# EAGLE design PCB-BI8-3x5C3_V2 (EAGLE 7.1.0)

## Sheet 1 of 2
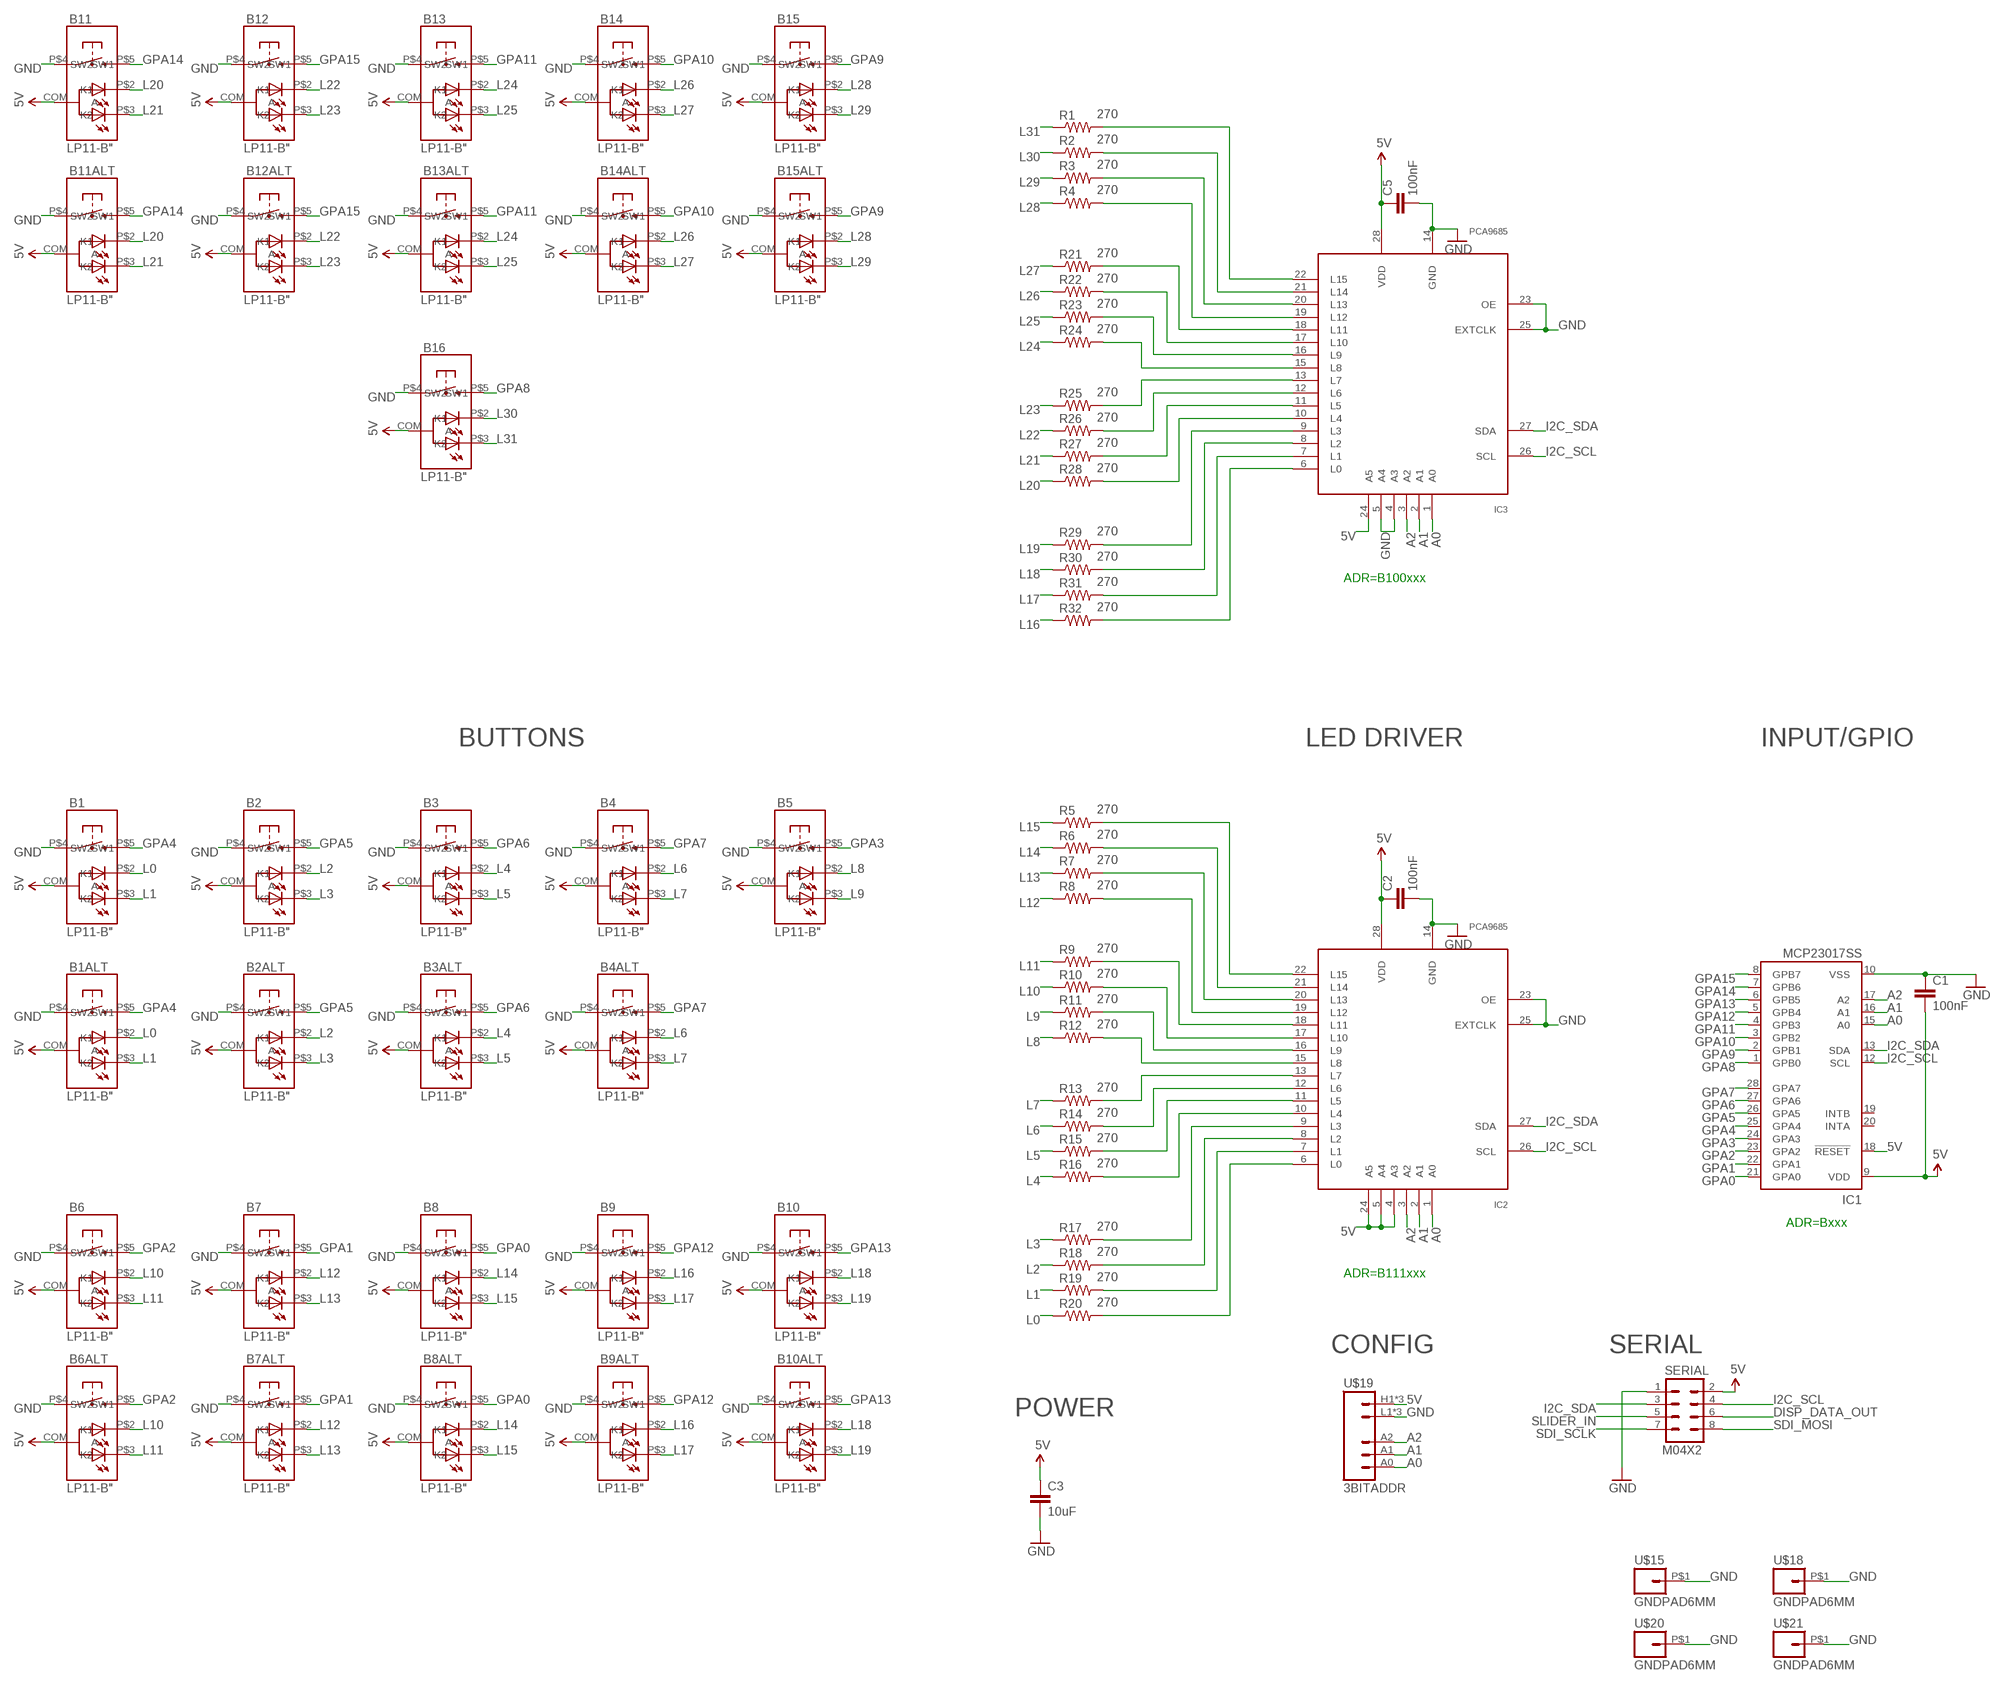
[diagram p0: schematic, sheet 1]

### Parts
B1  LP11-B"  [LP11]
B1ALT  LP11-B"  [LP11]
B2  LP11-B"  [LP11]
B2ALT  LP11-B"  [LP11]
B3  LP11-B"  [LP11]
B3ALT  LP11-B"  [LP11]
B4  LP11-B"  [LP11]
B4ALT  LP11-B"  [LP11]
B5  LP11-B"  [LP11]
B6  LP11-B"  [LP11]
B6ALT  LP11-B"  [LP11]
B7  LP11-B"  [LP11]
B7ALT  LP11-B"  [LP11]
B8  LP11-B"  [LP11]
B8ALT  LP11-B"  [LP11]
B9  LP11-B"  [LP11]
B9ALT  LP11-B"  [LP11]
B10  LP11-B"  [LP11]
B10ALT  LP11-B"  [LP11]
B11  LP11-B"  [LP11]
B11ALT  LP11-B"  [LP11]
B12  LP11-B"  [LP11]
B12ALT  LP11-B"  [LP11]
B13  LP11-B"  [LP11]
B13ALT  LP11-B"  [LP11]
B14  LP11-B"  [LP11]
B14ALT  LP11-B"  [LP11]
B15  LP11-B"  [LP11]
B15ALT  LP11-B"  [LP11]
B16  LP11-B"  [LP11]
C1  100nF  CAP0603-CAP  [0603-CAP]
C2  100nF  CAP0603-CAP  [0603-CAP]
C3  10uF  CAP0805  [0805]
C5  100nF  CAP0603-CAP  [0603-CAP]
IC1  MCP23017SS  [SSOP28]
IC2  PCA9685  [TSSOP28]
IC3  PCA9685  [TSSOP28]
R1  270  RESISTOR0603-RES  [0603-RES]
R2  270  RESISTOR0603-RES  [0603-RES]
R3  270  RESISTOR0603-RES  [0603-RES]
R4  270  RESISTOR0603-RES  [0603-RES]
R5  270  RESISTOR0603-RES  [0603-RES]
R6  270  RESISTOR0603-RES  [0603-RES]
R7  270  RESISTOR0603-RES  [0603-RES]
R8  270  RESISTOR0603-RES  [0603-RES]
R9  270  RESISTOR0603-RES  [0603-RES]
R10  270  RESISTOR0603-RES  [0603-RES]
R11  270  RESISTOR0603-RES  [0603-RES]
R12  270  RESISTOR0603-RES  [0603-RES]
R13  270  RESISTOR0603-RES  [0603-RES]
R14  270  RESISTOR0603-RES  [0603-RES]
R15  270  RESISTOR0603-RES  [0603-RES]
R16  270  RESISTOR0603-RES  [0603-RES]
R17  270  RESISTOR0603-RES  [0603-RES]
R18  270  RESISTOR0603-RES  [0603-RES]
R19  270  RESISTOR0603-RES  [0603-RES]
R20  270  RESISTOR0603-RES  [0603-RES]
R21  270  RESISTOR0603-RES  [0603-RES]
R22  270  RESISTOR0603-RES  [0603-RES]
R23  270  RESISTOR0603-RES  [0603-RES]
R24  270  RESISTOR0603-RES  [0603-RES]
R25  270  RESISTOR0603-RES  [0603-RES]
R26  270  RESISTOR0603-RES  [0603-RES]
R27  270  RESISTOR0603-RES  [0603-RES]
R28  270  RESISTOR0603-RES  [0603-RES]
R29  270  RESISTOR0603-RES  [0603-RES]
R30  270  RESISTOR0603-RES  [0603-RES]
R31  270  RESISTOR0603-RES  [0603-RES]
R32  270  RESISTOR0603-RES  [0603-RES]
SERIAL  M04X2  [2X4]
U$15  GNDPAD6MM  [3.2MMPAD6MM]
U$18  GNDPAD6MM  [3.2MMPAD6MM]
U$19  3BITADDR  [3BITADDR]
U$20  GNDPAD6MM  [3.2MMPAD6MM]
U$21  GNDPAD6MM  [3.2MMPAD6MM]

### Nets
5V [Power]: B1.COM(A) B1ALT.COM(A) B2.COM(A) B2ALT.COM(A) B3.COM(A) B3ALT.COM(A) B4.COM(A) B4ALT.COM(A) B5.COM(A) B6.COM(A) B6ALT.COM(A) B7.COM(A) B7ALT.COM(A) B8.COM(A) B8ALT.COM(A) B9.COM(A) B9ALT.COM(A) B10.COM(A) B10ALT.COM(A) B11.COM(A) B11ALT.COM(A) B12.COM(A) B12ALT.COM(A) B13.COM(A) B13ALT.COM(A) B14.COM(A) B14ALT.COM(A) B15.COM(A) B15ALT.COM(A) B16.COM(A) C1.2 C2.1 C3.1 C5.1 IC1.9(VDD) IC1.18(!RESET) IC2.4(A3) IC2.5(A4) IC2.24(A5) IC2.28(VDD) IC3.24(A5) IC3.28(VDD) SERIAL.2 U$19.H1(VCC) U$19.H2(VCC) U$19.H3(VCC)
A0: IC1.15(A0) IC2.1(A0) IC3.1(A0) U$19.A0
A1: IC1.16(A1) IC2.2(A1) IC3.2(A1) U$19.A1
A2: IC1.17(A2) IC2.3(A2) IC3.3(A2) U$19.A2
DISP_DATA_OUT: SERIAL.6
GND [Power]: B1.P$4(SW1) B1ALT.P$4(SW1) B2.P$4(SW1) B2ALT.P$4(SW1) B3.P$4(SW1) B3ALT.P$4(SW1) B4.P$4(SW1) B4ALT.P$4(SW1) B5.P$4(SW1) B6.P$4(SW1) B6ALT.P$4(SW1) B7.P$4(SW1) B7ALT.P$4(SW1) B8.P$4(SW1) B8ALT.P$4(SW1) B9.P$4(SW1) B9ALT.P$4(SW1) B10.P$4(SW1) B10ALT.P$4(SW1) B11.P$4(SW1) B11ALT.P$4(SW1) B12.P$4(SW1) B12ALT.P$4(SW1) B13.P$4(SW1) B13ALT.P$4(SW1) B14.P$4(SW1) B14ALT.P$4(SW1) B15.P$4(SW1) B15ALT.P$4(SW1) B16.P$4(SW1) C1.1 C2.2 C3.2 C5.2 IC1.10(VSS) IC2.14(GND) IC2.23(OE) IC2.25(EXTCLK) IC3.4(A3) IC3.5(A4) IC3.14(GND) IC3.23(OE) IC3.25(EXTCLK) SERIAL.1 U$15.P$1 U$18.P$1 U$19.L1(GND) U$19.L2(GND) U$19.L3(GND) U$20.P$1 U$21.P$1
GPA0: B8.P$5(SW2) B8ALT.P$5(SW2) IC1.21(GPA0)
GPA1: B7.P$5(SW2) B7ALT.P$5(SW2) IC1.22(GPA1)
GPA2: B6.P$5(SW2) B6ALT.P$5(SW2) IC1.23(GPA2)
GPA3: B5.P$5(SW2) IC1.24(GPA3)
GPA4: B1.P$5(SW2) B1ALT.P$5(SW2) IC1.25(GPA4)
GPA5: B2.P$5(SW2) B2ALT.P$5(SW2) IC1.26(GPA5)
GPA6: B3.P$5(SW2) B3ALT.P$5(SW2) IC1.27(GPA6)
GPA7: B4.P$5(SW2) B4ALT.P$5(SW2) IC1.28(GPA7)
GPA8: B16.P$5(SW2) IC1.1(GPB0)
GPA9: B15.P$5(SW2) B15ALT.P$5(SW2) IC1.2(GPB1)
GPA10: B14.P$5(SW2) B14ALT.P$5(SW2) IC1.3(GPB2)
GPA11: B13.P$5(SW2) B13ALT.P$5(SW2) IC1.4(GPB3)
GPA12: B9.P$5(SW2) B9ALT.P$5(SW2) IC1.5(GPB4)
GPA13: B10.P$5(SW2) B10ALT.P$5(SW2) IC1.6(GPB5)
GPA14: B11.P$5(SW2) B11ALT.P$5(SW2) IC1.7(GPB6)
GPA15: B12.P$5(SW2) B12ALT.P$5(SW2) IC1.8(GPB7)
I2C_SCL: IC1.12(SCL) IC2.26(SCL) IC3.26(SCL) SERIAL.4
I2C_SDA: IC1.13(SDA) IC2.27(SDA) IC3.27(SDA) SERIAL.3
L0: B1.P$2(K1) B1ALT.P$2(K1) R20.1
L1: B1.P$3(K2) B1ALT.P$3(K2) R19.1
L2: B2.P$2(K1) B2ALT.P$2(K1) R18.1
L3: B2.P$3(K2) B2ALT.P$3(K2) R17.1
L4: B3.P$2(K1) B3ALT.P$2(K1) R16.1
L5: B3.P$3(K2) B3ALT.P$3(K2) R15.1
L6: B4.P$2(K1) B4ALT.P$2(K1) R14.1
L7: B4.P$3(K2) B4ALT.P$3(K2) R13.1
L8: B5.P$2(K1) R12.1
L9: B5.P$3(K2) R11.1
L10: B6.P$2(K1) B6ALT.P$2(K1) R10.1
L11: B6.P$3(K2) B6ALT.P$3(K2) R9.1
L12: B7.P$2(K1) B7ALT.P$2(K1) R8.1
L13: B7.P$3(K2) B7ALT.P$3(K2) R7.1
L14: B8.P$2(K1) B8ALT.P$2(K1) R6.1
L15: B8.P$3(K2) B8ALT.P$3(K2) R5.1
L16: B9.P$2(K1) B9ALT.P$2(K1) R32.1
L17: B9.P$3(K2) B9ALT.P$3(K2) R31.1
L18: B10.P$2(K1) B10ALT.P$2(K1) R30.1
L19: B10.P$3(K2) B10ALT.P$3(K2) R29.1
L20: B11.P$2(K1) B11ALT.P$2(K1) R28.1
L21: B11.P$3(K2) B11ALT.P$3(K2) R27.1
L22: B12.P$2(K1) B12ALT.P$2(K1) R26.1
L23: B12.P$3(K2) B12ALT.P$3(K2) R25.1
L24: B13.P$2(K1) B13ALT.P$2(K1) R24.1
L25: B13.P$3(K2) B13ALT.P$3(K2) R23.1
L26: B14.P$2(K1) B14ALT.P$2(K1) R22.1
L27: B14.P$3(K2) B14ALT.P$3(K2) R21.1
L28: B15.P$2(K1) B15ALT.P$2(K1) R4.1
L29: B15.P$3(K2) B15ALT.P$3(K2) R3.1
L30: B16.P$2(K1) R2.1
L31: B16.P$3(K2) R1.1
N$1: IC3.13(L7) R25.2
N$2: IC3.12(L6) R26.2
N$3: IC3.11(L5) R27.2
N$4: IC2.13(L7) R13.2
N$5: IC2.12(L6) R14.2
N$6: IC3.10(L4) R28.2
N$7: IC2.11(L5) R15.2
N$8: IC3.9(L3) R29.2
N$9: IC2.10(L4) R16.2
N$10: IC2.9(L3) R17.2
N$11: IC2.8(L2) R18.2
N$12: IC2.7(L1) R19.2
N$13: IC3.8(L2) R30.2
N$14: IC3.7(L1) R31.2
N$15: IC3.6(L0) R32.2
N$16: IC3.15(L8) R24.2
N$17: IC3.16(L9) R23.2
N$18: IC3.17(L10) R22.2
N$19: IC2.6(L0) R20.2
N$20: IC2.15(L8) R12.2
N$21: IC2.16(L9) R11.2
N$22: IC2.17(L10) R10.2
N$23: IC2.18(L11) R9.2
N$24: IC2.19(L12) R8.2
N$25: IC2.20(L13) R7.2
N$26: IC2.21(L14) R6.2
N$27: IC2.22(L15) R5.2
N$28: IC3.18(L11) R21.2
N$29: IC3.19(L12) R4.2
N$30: IC3.20(L13) R3.2
N$31: IC3.21(L14) R2.2
N$32: IC3.22(L15) R1.2
SDI_MOSI: SERIAL.8
SDI_SCLK: SERIAL.7
SLIDER_IN: SERIAL.5
Unconnected: IC1.19(INTB) IC1.20(INTA)

### Notes on the sheet
- ADR=B100xxx
- BUTTONS | LED DRIVER | INPUT/GPIO
- ADR=Bxxx
- ADR=B111xxx
- CONFIG | SERIAL
- POWER

## Sheet 2 of 2

## Library data of the parts
B1 B1ALT B2 B2ALT B3 B3ALT B4 B4ALT B5 B6 B6ALT B7 B7ALT B8 B8ALT B9 B9ALT B10 B10ALT B11 B11ALT B12 B12ALT B13 B13ALT B14 B14ALT B15 B15ALT B16 = SKAARHOJ:LP11-B
C1-C3 C5 = SparkFun:CAP: Capacitor Standard 0603 ceramic capacitor, and 0.1" leaded capacitor.
IC1 = microchip:MCP23017: http://ww1.microchip.com/downloads/en/DeviceDoc/21952a.pdf Source: http://ww1.microchip.com/downloads/en/DeviceDoc/21952a.pdf; MF: MICROCHIP; MPN: MCP23017-E/SS; OC_FARNELL: 1467674; OC_NEWARK: 31K2960
IC2 IC3 = wsmith:PCA9685
R1-R32 = SparkFun:RESISTOR: Resistor Basic schematic elements and footprints for 0603, 1206, and PTH resistors.
SERIAL = SparkFun:M04X2
U$15 U$18 U$20 U$21 = SKAARHOJ:GNDPAD
U$19 = SKAARHOJ:3BITADDR

## Net classes
0 default: width 0.203 mm, drill 0.406 mm, clearance 0.203 mm
1 Power: width 0.406 mm, drill 0.61 mm, clearance 0.203 mm

## Board
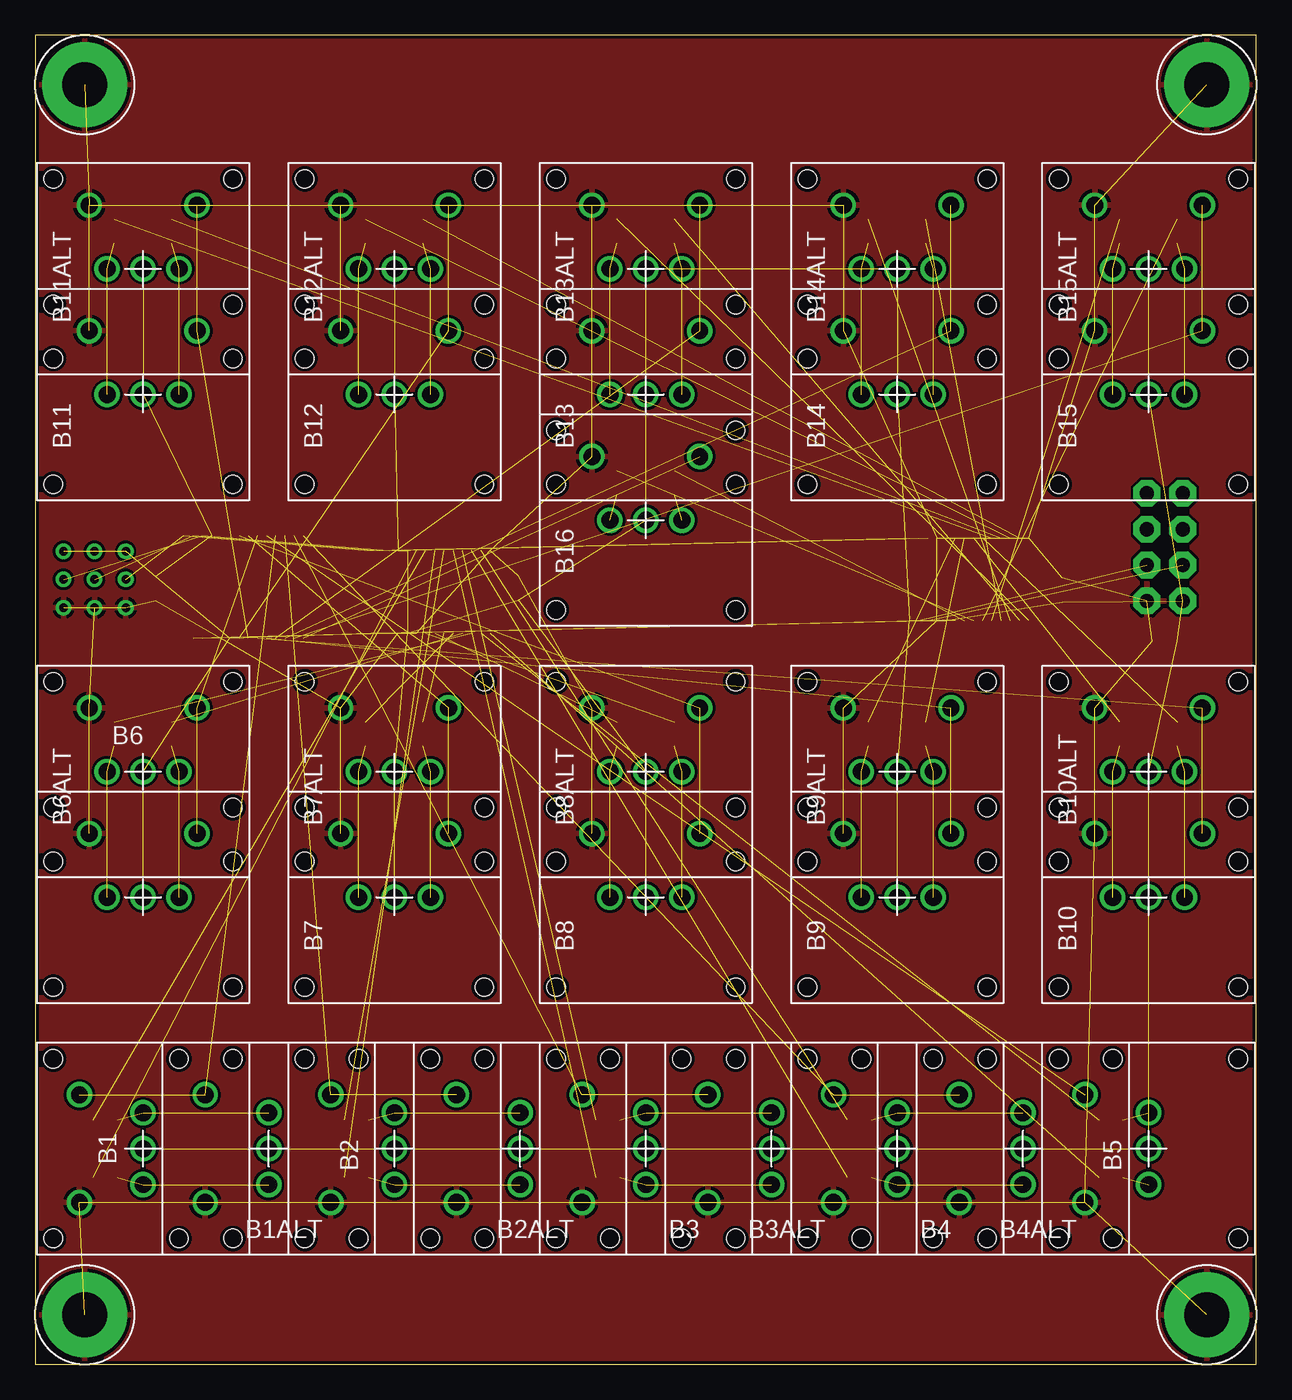
[diagram p1: board, top side]
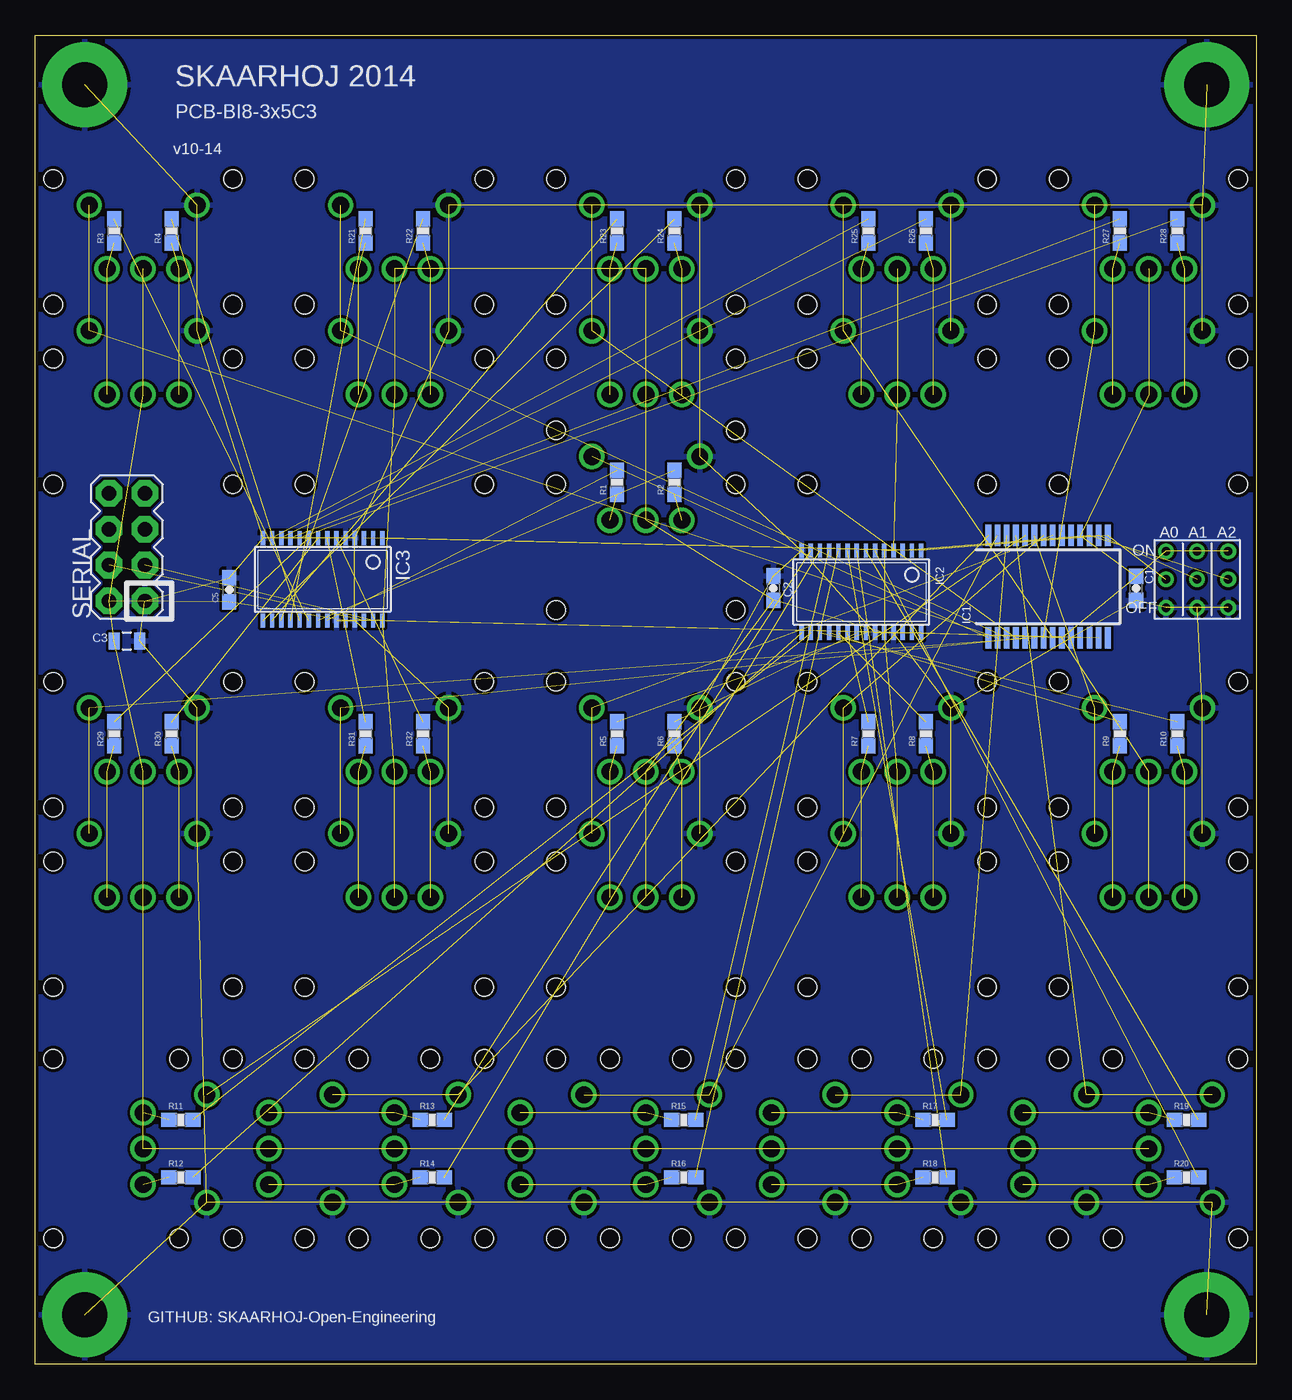
[diagram p2: board, bottom side, seen from below]

Size 86.36 x 93.98 mm. Coordinates in mm from the lower left corner, seen from the top.
Outline: 0,0 86.36,0 86.36,93.98 0,93.98 0,0
Copper layers (1*16): Top 0.035mm / dielectric 1.5mm / Bottom 0.035mm
Design rules "Fusion_eagle_rule_v1.1": minimum track width 6mil, minimum drill 12mil, track to track 6mil, track to pad 6mil, pad to pad 6mil, via to via 6mil, smd to smd 0mil, copper to edge 10mil, drill to drill 10mil, minimum pad ring 10mil, minimum via ring 6mil, stop-mask expansion 2mil, vias tented up to drill 100mil, thermal gap 10mil

### Footprints (pad centres in the part's own frame; a part is rotated, then mirrored left to right if it is on the bottom)
LP11 = drill 1.2: COM 0,0; P$2 0,2.54; P$3 0,-2.54; P$4 4.5,3.81; P$5 4.5,-3.81 | hole 1.3: -6.35,6.35; 6.35,6.35; 6.35,-6.35; -6.35,-6.35
0603-CAP = smd 1.1 x 1: 1 -0.85,0; 2 0.85,0
0805 = smd 0.8 x 1.2: 1 -0.9,0; 2 0.9,0
SSOP28 = smd 0.4 x 1.5: 1 -4.225,-3.625; 2 -3.575,-3.625; 3 -2.925,-3.625; 4 -2.275,-3.625; 5 -1.625,-3.625; 6 -0.975,-3.625; 7 -0.325,-3.625; 8 0.325,-3.625; 9 0.975,-3.625; 10 1.625,-3.625; 11 2.275,-3.625; 12 2.925,-3.625; 13 3.575,-3.625; 14 4.225,-3.625; 15 4.225,3.625; 16 3.575,3.625; 17 2.925,3.625; 18 2.275,3.625; 19 1.625,3.625; 20 0.975,3.625; 21 0.325,3.625; 22 -0.325,3.625; 23 -0.975,3.625; 24 -1.625,3.625; 25 -2.275,3.625; 26 -2.925,3.625; 27 -3.575,3.625; 28 -4.225,3.625
TSSOP28 = smd 0.305 x 0.991: 1 -4.225,-2.918; 2 -3.575,-2.918; 3 -2.925,-2.918; 4 -2.275,-2.918; 5 -1.625,-2.918; 6 -0.975,-2.918; 7 -0.325,-2.918; 8 0.325,-2.918; 9 0.975,-2.918; 10 1.625,-2.918; 11 2.275,-2.918; 12 2.925,-2.918; 13 3.575,-2.918; 14 4.225,-2.918; 15 4.225,2.918; 16 3.575,2.918; 17 2.925,2.918; 18 2.275,2.918; 19 1.625,2.918; 20 0.975,2.918; 21 0.325,2.918; 22 -0.325,2.918; 23 -0.975,2.918; 24 -1.625,2.918; 25 -2.275,2.918; 26 -2.925,2.918; 27 -3.575,2.918; 28 -4.225,2.918
0603-RES = smd 1.1 x 1: 1 -0.85,0; 2 0.85,0
2X4 = drill 1.016 pad 1.88 octagon: 1 -3.81,-1.27; 2 -3.81,1.27; 3 -1.27,-1.27; 4 -1.27,1.27; 5 1.27,-1.27; 6 1.27,1.27; 7 3.81,-1.27; 8 3.81,1.27
3.2MMPAD6MM = drill 3.2 pad 6: P$1 0,0
3BITADDR = drill 0.6: A0 -2.2,0; A1 0,0; A2 2.2,0; H1 -2.2,2; H2 0,2; H3 2.2,2; L1 -2.2,-2; L2 0,-2; L3 2.2,-2

### Placement (x,y rotation side)
B1  7.62,15.24 180 top
B1ALT  16.51,15.24 180 top
B2  25.4,15.24 180 top
B2ALT  34.29,15.24 180 top
B3  43.18,15.24 180 top
B3ALT  52.07,15.24 180 top
B4  60.96,15.24 180 top
B4ALT  69.85,15.24 180 top
B5  78.74,15.24 180 top
B6  7.62,33.02 90 top
B6ALT  7.62,41.91 90 top
B7  25.4,33.02 90 top
B7ALT  25.4,41.91 90 top
B8  43.18,33.02 90 top
B8ALT  43.18,41.91 90 top
B9  60.96,33.02 90 top
B9ALT  60.96,41.91 90 top
B10  78.74,33.02 90 top
B10ALT  78.74,41.91 90 top
B11  7.62,68.58 90 top
B11ALT  7.62,77.47 90 top
B12  25.4,68.58 90 top
B12ALT  25.4,77.47 90 top
B13  43.18,68.58 90 top
B13ALT  43.18,77.47 90 top
B14  60.96,68.58 90 top
B14ALT  60.96,77.47 90 top
B15  78.74,68.58 90 top
B15ALT  78.74,77.47 90 top
B16  43.18,59.69 90 top
C1  8.51,54.86 90 bottom
C2  34.16,54.89 90 bottom
C3  79.88,51.16 0 bottom
C5  72.64,54.76 90 bottom
IC1  14.73,54.99 0 bottom
IC2  27.94,54.61 180 bottom
IC3  66.04,55.5 180 bottom
R1  45.21,62.36 90 bottom
R2  41.15,62.36 90 bottom
R3  80.77,80.14 90 bottom
R4  76.71,80.14 90 bottom
R5  45.21,44.58 90 bottom
R6  41.15,44.58 90 bottom
R7  27.43,44.58 90 bottom
R8  23.37,44.58 90 bottom
R9  9.65,44.58 90 bottom
R10  5.59,44.58 90 bottom
R11  76.07,17.27 0 bottom
R12  76.07,13.21 0 bottom
R13  58.29,17.27 0 bottom
R14  58.29,13.21 0 bottom
R15  40.51,17.27 0 bottom
R16  40.51,13.21 0 bottom
R17  22.73,17.27 0 bottom
R18  22.73,13.21 0 bottom
R19  4.95,17.27 0 bottom
R20  4.95,13.21 0 bottom
R21  62.99,80.14 90 bottom
R22  58.93,80.14 90 bottom
R23  45.21,80.14 90 bottom
R24  41.15,80.14 90 bottom
R25  27.43,80.14 90 bottom
R26  23.37,80.14 90 bottom
R27  9.65,80.14 90 bottom
R28  5.59,80.14 90 bottom
R29  80.77,44.58 90 bottom
R30  76.71,44.58 90 bottom
R31  62.99,44.58 90 bottom
R32  58.93,44.58 90 bottom
SERIAL  79.88,57.78 90 bottom
U$15  3.5,3.5 0 top
U$18  82.86,3.5 0 top
U$19  4.19,55.5 0 bottom
U$20  3.5,90.48 0 top
U$21  82.86,90.48 0 top

### Tracks (layer width: path | path; a pad name or v marks a point on that pad's centre or on a via)
5V  (45 unrouted)
A0  (3 unrouted)
A1  (3 unrouted)
A2  (3 unrouted)
GND  (50 unrouted)
  pour Top: 0,0 86.36,0 86.36,93.98 0,93.98
  pour Bottom: 0,0 86.36,0 86.36,93.98 0,93.98
GPA0  (2 unrouted)
GPA1  (2 unrouted)
GPA2  (2 unrouted)
GPA3  (1 unrouted)
GPA4  (2 unrouted)
GPA5  (2 unrouted)
GPA6  (2 unrouted)
GPA7  (2 unrouted)
GPA8  (1 unrouted)
GPA9  (2 unrouted)
GPA10  (2 unrouted)
GPA11  (2 unrouted)
GPA12  (2 unrouted)
GPA13  (2 unrouted)
GPA14  (2 unrouted)
GPA15  (2 unrouted)
I2C_SCL  (3 unrouted)
I2C_SDA  (3 unrouted)
L0  (2 unrouted)
L1  (2 unrouted)
L2  (2 unrouted)
L3  (2 unrouted)
L4  (2 unrouted)
L5  (2 unrouted)
L6  (2 unrouted)
L7  (2 unrouted)
L8  (1 unrouted)
L9  (1 unrouted)
L10  (2 unrouted)
L11  (2 unrouted)
L12  (2 unrouted)
L13  (2 unrouted)
L14  (2 unrouted)
L15  (2 unrouted)
L16  (2 unrouted)
L17  (2 unrouted)
L18  (2 unrouted)
L19  (2 unrouted)
L20  (2 unrouted)
L21  (2 unrouted)
L22  (2 unrouted)
L23  (2 unrouted)
L24  (2 unrouted)
L25  (2 unrouted)
L26  (2 unrouted)
L27  (2 unrouted)
L28  (2 unrouted)
L29  (2 unrouted)
L30  (1 unrouted)
L31  (1 unrouted)
N$1  (1 unrouted)
N$2  (1 unrouted)
N$3  (1 unrouted)
N$4  (1 unrouted)
N$5  (1 unrouted)
N$6  (1 unrouted)
N$7  (1 unrouted)
N$8  (1 unrouted)
N$9  (1 unrouted)
N$10  (1 unrouted)
N$11  (1 unrouted)
N$12  (1 unrouted)
N$13  (1 unrouted)
N$14  (1 unrouted)
N$15  (1 unrouted)
N$16  (1 unrouted)
N$17  (1 unrouted)
N$18  (1 unrouted)
N$19  (1 unrouted)
N$20  (1 unrouted)
N$21  (1 unrouted)
N$22  (1 unrouted)
N$23  (1 unrouted)
N$24  (1 unrouted)
N$25  (1 unrouted)
N$26  (1 unrouted)
N$27  (1 unrouted)
N$28  (1 unrouted)
N$29  (1 unrouted)
N$30  (1 unrouted)
N$31  (1 unrouted)
N$32  (1 unrouted)

### Text on the board
_bsilk: SKAARHOJ 2014 | PCB-BI8-3x5C3 | v10-14 | GITHUB: SKAARHOJ-Open-Engineering